# Altium schematic sheet Display7Seg.SCHDOC
size B
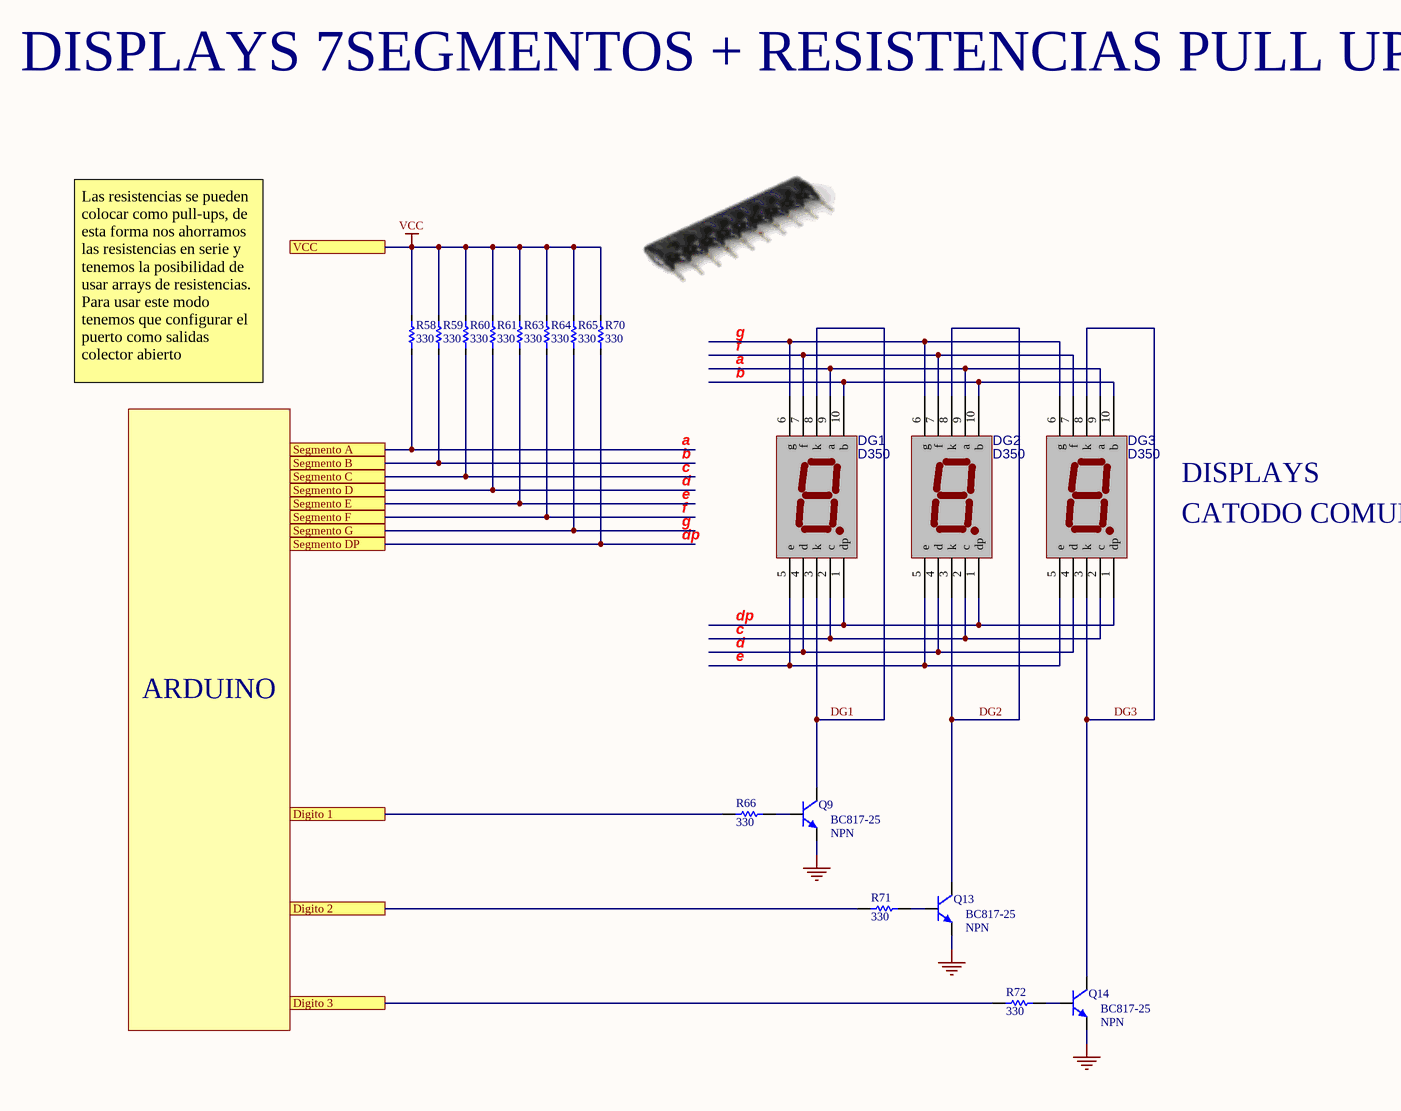
[diagram p0: Display7Seg.SCHDOC]

## Parts
DG1  D350  [DISPLAY 7SEG 34x24]
DG2  D350  [DISPLAY 7SEG 34x24]
DG3  D350  [DISPLAY 7SEG 34x24]
Q9  BC817-25  [SOT23-3]
Q13  BC817-25  [SOT23-3]
Q14  BC817-25  [SOT23-3]
R58  value 330  [0603]  (hidden comment: 470)
R59  value 330  [0603]  (hidden comment: 470)
R60  value 330  [0603]  (hidden comment: 470)
R61  value 330  [0603]  (hidden comment: 470)
R63  value 330  [0603]  (hidden comment: 470)
R64  value 330  [0603]  (hidden comment: 470)
R65  value 330  [0603]  (hidden comment: 470)
R66  330  [0603]
R70  value 330  [0603]  (hidden comment: 470)
R71  330  [0603]
R72  330  [0603]

## Ports
Digito 1, Digito 2, Digito 3, Segmento A, Segmento B, Segmento C, Segmento D, Segmento DP, Segmento E, Segmento F, Segmento G, VCC

## Nets
GND: Q9.2(E) Q13.2(E) Q14.2(E)
VCC: R58.1 R59.1 R60.1 R61.1 R63.1 R64.1 R65.1 R70.1 ; port VCC
a: DG1.9(a) DG2.9(a) DG3.9(a) R58.2 ; port Segmento A
b: DG1.10(b) DG2.10(b) DG3.10(b) R59.2 ; port Segmento B
c: DG1.2(c) DG2.2(c) DG3.2(c) R60.2 ; port Segmento C
d: DG1.4(d) DG2.4(d) DG3.4(d) R61.2 ; port Segmento D
DG1: DG1.3(k) DG1.8(k) Q9.3(C)
DG2: DG2.3(k) DG2.8(k) Q13.3(C)
DG3: DG3.3(k) DG3.8(k) Q14.3(C)
Digito 1: R66.1 ; port Digito 1
Digito 2: R71.1 ; port Digito 2
Digito 3: R72.1 ; port Digito 3
dp: DG1.1(dp) DG2.1(dp) DG3.1(dp) R70.2 ; port Segmento DP
e: DG1.5(e) DG2.5(e) DG3.5(e) R63.2 ; port Segmento E
f: DG1.7(f) DG2.7(f) DG3.7(f) R64.2 ; port Segmento F
g: DG1.6(g) DG2.6(g) DG3.6(g) R65.2 ; port Segmento G
NetQ9_1: Q9.1(B) R66.2
NetQ13_1: Q13.1(B) R71.2
NetQ14_1: Q14.1(B) R72.2

## Notes on the sheet
- DISPLAYS 7SEGMENTOS + RESISTENCIAS PULL UP
- Las resistencias se pueden colocar como pull-ups, de esta forma nos ahorramos las resistencias en serie y tenemos la posibilidad de usar arrays de resistencias.
  Para usar este modo tenemos que configurar el puerto como salidas colector abierto
- DISPLAYS
- CATODO COMUN
- ARDUINO
- (near Q9) NPN
- (near Q13) NPN
- (near Q14) NPN

## Library data of the parts
DG1-DG3 = DGT350: DIGITO DE 1/2 PULGADA; Text Field1: 0,4; 0.54: .54
Q9 Q13 Q14 = BC817-25: Transistor NPN; Manufacturer: Fairchild Semiconductor; Revised: 11-July-2000: SIM Model Added.; Class: Discrete; SubClass: BJT - Low Power; Published: 8/06/2000; Publisher: Altium Hobart Technology Centre
R58-R61 R63-R66 R70-R72 = Res1: Resistencia; Manufacturer: Generic Components; Class I: Passive; Class II: Resistor; Published: 8-Jun-2000; Revision: July-2002: Re-released for DXP Platform.; Publisher: Altium Limited
  R66 R71 R72: Value: 330